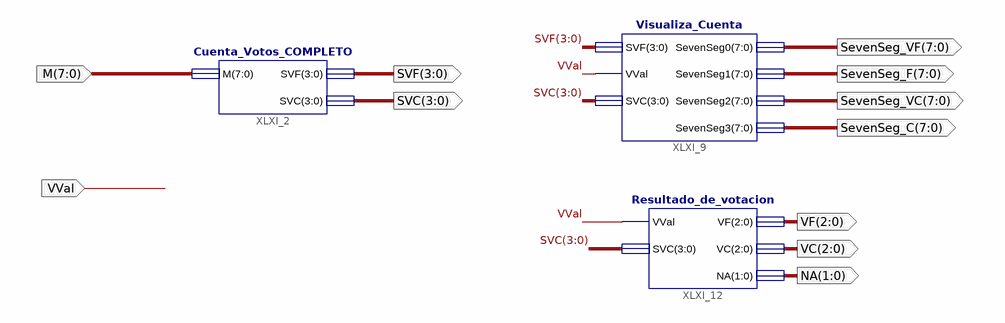
[diagram p0: schematic sheet 1]
// Xilinx ISE schematic Modulo_general.sch (spartan6) as structural Verilog: 3 symbols, 11 ports
module Modulo_general (
  input  VVal,
  input  [7:0] M,
  output [3:0] SVC,
  output [3:0] SVF,
  output [2:0] VF,
  output [2:0] VC,
  output [1:0] NA,
  output [7:0] SevenSeg_VF,
  output [7:0] SevenSeg_F,
  output [7:0] SevenSeg_VC,
  output [7:0] SevenSeg_C
);

  Cuenta_Votos_COMPLETO XLXI_2 (.M(M), .SVC(SVC), .SVF(SVF));
  Visualiza_Cuenta XLXI_9 (
    .SevenSeg0(SevenSeg_VF), .SevenSeg1(SevenSeg_F), .SevenSeg2(SevenSeg_VC), .SevenSeg3(SevenSeg_C),
    .SVC(SVC), .SVF(SVF), .VVal(VVal));
  Resultado_de_votacion XLXI_12 (.NA(NA), .SVC(SVC), .VC(VC), .VF(VF), .VVal(VVal));
endmodule
